# Altium project CRE401_REPRO.PrjPCB
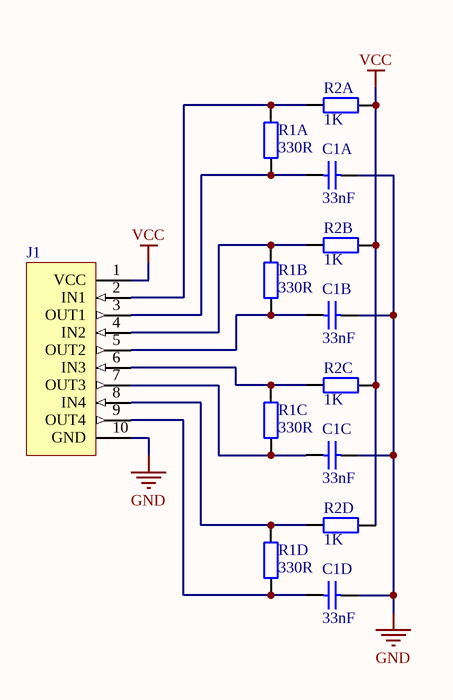
[diagram p0: CRE401.SchDoc]
1 sheet, 13 parts. Net scope: global (net labels, ports and power ports of the same name join across sheets).
Board file: CRE401.PcbDoc

## Sheet CRE401.SchDoc
size A4; DrawnBy: Jos van Mourik; DocumentNumber: CRE401 Reproduction; Revision: 2; SheetNumber: 1; SheetTotal: 1

### Parts
C1A  value 33nF  [CAPC1608N]  (hidden comment: Cap0603)
C1B  value 33nF  [CAPC1608N]  (hidden comment: Cap0603)
C1C  value 33nF  [CAPC1608N]  (hidden comment: Cap0603)
C1D  value 33nF  [CAPC1608N]  (hidden comment: Cap0603)
J1  CRE401 HEADER  [HEADER10_SMD_THT]  (value not drawn)
R1A  value 330R  [RESC1608N]  (hidden comment: Res0603)
R1B  value 330R  [RESC1608N]  (hidden comment: Res0603)
R1C  value 330R  [RESC1608N]  (hidden comment: Res0603)
R1D  value 330R  [RESC1608N]  (hidden comment: Res0603)
R2A  value 1K  [RESC1608N]  (hidden comment: Res0603)
R2B  value 1K  [RESC1608N]  (hidden comment: Res0603)
R2C  value 1K  [RESC1608N]  (hidden comment: Res0603)
R2D  value 1K  [RESC1608N]  (hidden comment: Res0603)

### Nets
GND: C1A.2 C1B.2 C1C.2 C1D.2 J1.10(GND)
VCC: J1.1(VCC) R2A.2 R2B.2 R2C.2 R2D.2
NetC1A_1: C1A.1 J1.3(OUT1) R1A.1
NetC1B_1: C1B.1 J1.5(OUT2) R1B.1
NetC1C_1: C1C.1 J1.7(OUT3) R1C.1
NetC1D_1: C1D.1 J1.9(OUT4) R1D.1
NetJ1_2: J1.2(IN1) R1A.2 R2A.1
NetJ1_4: J1.4(IN2) R1B.2 R2B.1
NetJ1_6: J1.6(IN3) R1C.2 R2C.1
NetJ1_8: J1.8(IN4) R1D.2 R2D.1

### Library data of the parts
C1A C1B C1C C1D = Cap0603: Capacitor (SMD), 0603; PackageReference: CAPC1608N
J1 = CRE401 HEADER: 10p 0.1" header, male, right angle or vertical
R1A R1B R1C R1D R2A R2B R2C R2D = Res0603: Resistor (SMD), 0603; PackageReference: RESC1608N